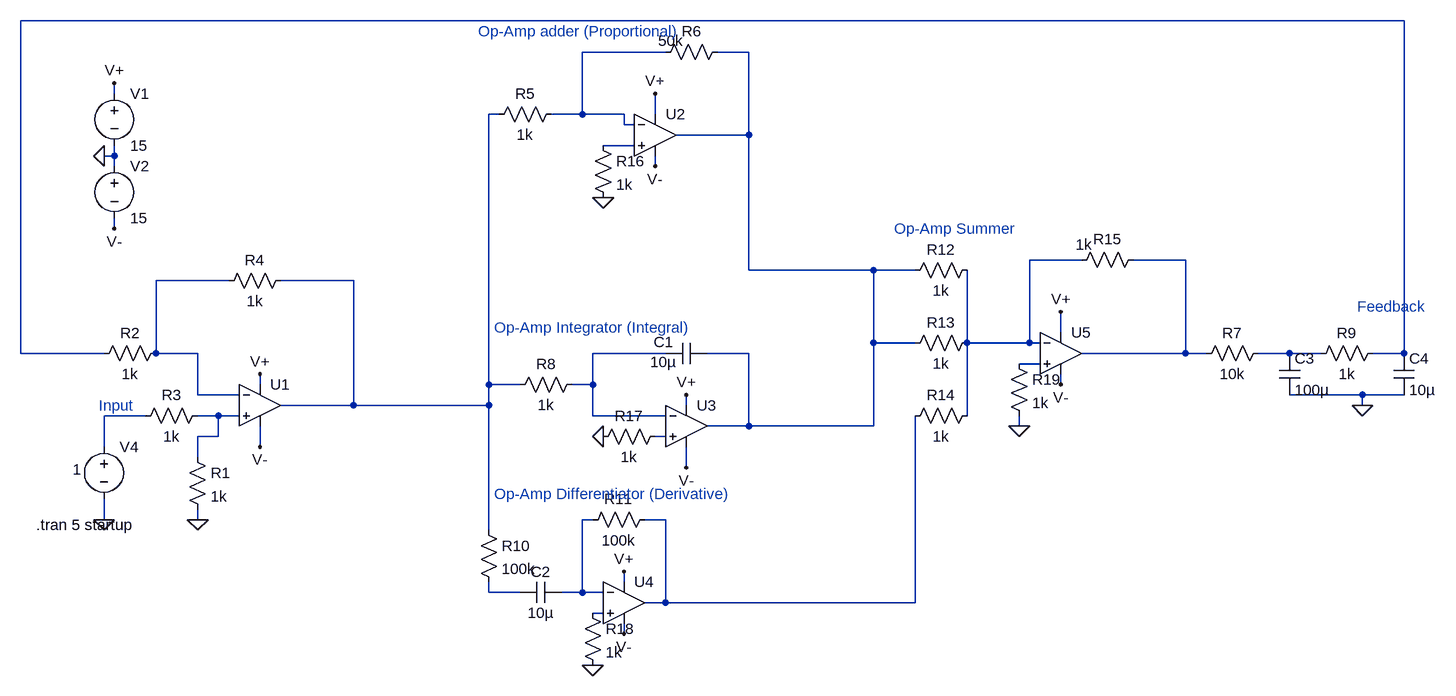
[diagram p0: schematic PID Controller.asc]
PID Controller.asc, the LTspice schematic file:
Version 4.1
SHEET 1 2156 680
WIRE 1408 -480 -720 -480
WIRE 272 -432 144 -432
WIRE 400 -432 352 -432
WIRE -576 -368 -576 -384
WIRE 16 -336 0 -336
WIRE 144 -336 144 -432
WIRE 144 -336 96 -336
WIRE 208 -336 144 -336
WIRE 256 -336 256 -368
WIRE 208 -320 208 -336
WIRE 224 -320 208 -320
WIRE 400 -304 400 -432
WIRE 400 -304 288 -304
WIRE 224 -288 176 -288
WIRE -576 -272 -576 -288
WIRE -576 -272 -592 -272
WIRE -576 -256 -576 -272
WIRE 256 -256 256 -272
WIRE -576 -160 -576 -176
WIRE 912 -112 832 -112
WIRE 1072 -112 992 -112
WIRE 400 -96 400 -304
WIRE 592 -96 400 -96
WIRE 656 -96 592 -96
WIRE -400 -80 -512 -80
WIRE -208 -80 -320 -80
WIRE 880 0 880 -32
WIRE 592 16 592 -96
WIRE 656 16 592 16
WIRE 736 16 736 -96
WIRE 832 16 832 -112
WIRE 832 16 736 16
WIRE 848 16 832 16
WIRE -720 32 -720 -480
WIRE -592 32 -720 32
WIRE -512 32 -512 -80
WIRE -448 32 -512 32
WIRE 272 32 160 32
WIRE 400 32 336 32
WIRE 1072 32 1072 -112
WIRE 1072 32 912 32
WIRE 1104 32 1072 32
WIRE 1232 32 1184 32
WIRE 1280 32 1232 32
WIRE 1408 32 1408 -480
WIRE 1408 32 1360 32
WIRE 848 48 816 48
WIRE -352 80 -352 64
WIRE 0 80 0 -336
WIRE 48 80 0 80
WIRE 160 80 160 32
WIRE 160 80 128 80
WIRE 880 80 880 64
WIRE -448 96 -448 32
WIRE -384 96 -448 96
WIRE 1344 96 1232 96
WIRE 1408 96 1344 96
WIRE -208 112 -208 -80
WIRE -208 112 -320 112
WIRE 0 112 0 80
WIRE 0 112 -208 112
WIRE 304 112 304 96
WIRE 1344 112 1344 96
WIRE -528 128 -592 128
WIRE -416 128 -448 128
WIRE -384 128 -416 128
WIRE 160 128 160 80
WIRE 272 128 160 128
WIRE 736 128 736 16
WIRE 400 144 400 32
WIRE 400 144 336 144
WIRE 592 144 592 16
WIRE 592 144 400 144
WIRE 816 144 816 128
WIRE -416 160 -416 128
WIRE -416 160 -448 160
WIRE 272 160 256 160
WIRE -592 176 -592 128
WIRE -352 176 -352 144
WIRE -448 192 -448 160
WIRE 304 208 304 176
WIRE -592 288 -592 256
WIRE -448 288 -448 272
WIRE 160 288 144 288
WIRE 272 288 240 288
WIRE 0 304 0 112
WIRE 208 384 208 368
WIRE 0 400 0 384
WIRE 48 400 0 400
WIRE 144 400 144 288
WIRE 144 400 112 400
WIRE 176 400 144 400
WIRE 272 416 272 288
WIRE 272 416 240 416
WIRE 656 416 656 128
WIRE 656 416 272 416
WIRE 176 432 160 432
WIRE 208 464 208 448
FLAG -448 288 0
FLAG -592 288 0
FLAG -592 -272 0
FLAG -576 -384 V+
FLAG 256 -368 V+
FLAG 880 -32 V+
FLAG 208 368 V+
FLAG 304 96 V+
FLAG -352 64 V+
FLAG 256 -256 V-
FLAG 304 208 V-
FLAG 208 464 V-
FLAG -352 176 V-
FLAG 880 80 V-
FLAG 1344 112 0
FLAG 176 -208 0
FLAG 176 160 0
FLAG 160 512 0
FLAG -576 -160 V-
FLAG 816 144 0
SYMBOL voltage -576 -384 R0
WINDOW 123 0 0 Left 0
WINDOW 39 0 0 Left 0
SYMATTR InstName V1
SYMATTR Value 15
SYMBOL voltage -576 -272 R0
WINDOW 123 0 0 Left 0
WINDOW 39 0 0 Left 0
SYMATTR InstName V2
SYMATTR Value 15
SYMBOL voltage -592 160 R0
WINDOW 3 -48 51 Left 2
WINDOW 123 0 0 Left 0
WINDOW 39 0 0 Left 0
SYMATTR Value 1
SYMATTR InstName V4
SYMBOL res -464 176 R0
SYMATTR InstName R1
SYMATTR Value 1k
SYMBOL res -496 16 R90
WINDOW 0 0 56 VBottom 2
WINDOW 3 32 56 VTop 2
SYMATTR InstName R2
SYMATTR Value 1k
SYMBOL res -432 112 R90
WINDOW 0 0 56 VBottom 2
WINDOW 3 32 56 VTop 2
SYMATTR InstName R3
SYMATTR Value 1k
SYMBOL res -304 -96 R90
WINDOW 0 0 56 VBottom 2
WINDOW 3 32 56 VTop 2
SYMATTR InstName R4
SYMATTR Value 1k
SYMBOL OpAmps\\UniversalOpAmp -352 112 R0
SYMATTR InstName U1
SYMBOL res 368 -448 R90
WINDOW 0 0 56 VBottom 2
WINDOW 3 -17 88 VTop 2
SYMATTR InstName R6
SYMATTR Value 50k
SYMBOL res 112 -352 R90
WINDOW 0 0 56 VBottom 2
WINDOW 3 32 56 VTop 2
SYMATTR InstName R5
SYMATTR Value 1k
SYMBOL OpAmps\\UniversalOpAmp 256 -304 R0
SYMATTR InstName U2
SYMBOL cap 336 16 R90
WINDOW 0 14 67 VBottom 2
WINDOW 3 14 67 VTop 2
SYMATTR InstName C1
SYMATTR Value 10µ
SYMBOL OpAmps\\UniversalOpAmp 304 144 R0
SYMATTR InstName U3
SYMBOL res 144 64 R90
WINDOW 0 0 56 VBottom 2
WINDOW 3 32 56 VTop 2
SYMATTR InstName R8
SYMATTR Value 1k
SYMBOL cap 112 384 R90
WINDOW 0 0 32 VBottom 2
WINDOW 3 32 32 VTop 2
SYMATTR InstName C2
SYMATTR Value 10µ
SYMBOL OpAmps\\UniversalOpAmp 208 416 R0
SYMATTR InstName U4
SYMBOL res -16 288 R0
SYMATTR InstName R10
SYMATTR Value 100k
SYMBOL res 752 -112 R90
WINDOW 0 0 56 VBottom 2
WINDOW 3 32 56 VTop 2
SYMATTR InstName R12
SYMATTR Value 1k
SYMBOL res 752 0 R90
WINDOW 0 0 56 VBottom 2
WINDOW 3 32 56 VTop 2
SYMATTR InstName R13
SYMATTR Value 1k
SYMBOL res 752 112 R90
WINDOW 0 0 56 VBottom 2
WINDOW 3 32 56 VTop 2
SYMATTR InstName R14
SYMATTR Value 1k
SYMBOL OpAmps\\UniversalOpAmp 880 32 R0
SYMATTR InstName U5
SYMBOL res 1008 -128 R90
WINDOW 0 0 56 VBottom 2
WINDOW 3 -23 92 VTop 2
SYMATTR InstName R15
SYMATTR Value 1k
SYMBOL res 256 272 R90
WINDOW 0 0 56 VBottom 2
WINDOW 3 32 56 VTop 2
SYMATTR InstName R11
SYMATTR Value 100k
SYMBOL res 1200 16 R90
WINDOW 0 0 56 VBottom 2
WINDOW 3 32 56 VTop 2
SYMATTR InstName R7
SYMATTR Value 10k
SYMBOL res 1376 16 R90
WINDOW 0 0 56 VBottom 2
WINDOW 3 32 56 VTop 2
SYMATTR InstName R9
SYMATTR Value 1k
SYMBOL cap 1216 32 R0
SYMATTR InstName C3
SYMATTR Value 100µ
SYMBOL cap 1392 32 R0
SYMATTR InstName C4
SYMATTR Value 10µ
SYMBOL res 160 -304 R0
SYMATTR InstName R16
SYMATTR Value 1k
SYMBOL res 272 144 R90
WINDOW 0 0 56 VBottom 2
WINDOW 3 32 56 VTop 2
SYMATTR InstName R17
SYMATTR Value 1k
SYMBOL res 144 416 R0
SYMATTR InstName R18
SYMATTR Value 1k
SYMBOL res 800 32 R0
SYMATTR InstName R19
SYMATTR Value 1k
TEXT -696 296 Left 2 !.tran 5 startup
TEXT -16 -464 Left 2 ;Op-Amp adder (Proportional)
TEXT 8 248 Left 2 ;Op-Amp Differentiator (Derivative)
TEXT 8 -8 Left 2 ;Op-Amp Integrator (Integral)
TEXT 624 -160 Left 2 ;Op-Amp Summer
TEXT 1336 -40 Left 2 ;Feedback
TEXT -600 112 Left 2 ;Input

The netlist it stands for:
* PID Controller.asc
V1 V+ 0 15
V2 0 V- 15
V4 N012 0 1
R1 N013 0 1k
R2 N008 N001 1k
R3 N013 N012 1k
R4 N004 N008 1k
X§U1 N013 N008 V+ V- N004 level1 Avol=1Meg GBW=10Meg Vos=0 En=0 Enk=0 In=0 Ink=0 Rin=500Meg  ; pins In+ In- V+ V- OUT
R6 N003 N002 50k
R5 N002 N004 1k
X§U2 N005 N002 V+ V- N003 level1 Avol=1Meg GBW=10Meg Vos=0 En=0 Enk=0 In=0 Ink=0 Rin=500Meg  ; pins In+ In- V+ V- OUT
C1 N003 N009 10µ
X§U3 N014 N009 V+ V- N003 level1 Avol=1Meg GBW=10Meg Vos=0 En=0 Enk=0 In=0 Ink=0 Rin=500Meg  ; pins In+ In- V+ V- OUT
R8 N009 N004 1k
C2 N015 N017 10µ
X§U4 N018 N015 V+ V- N016 level1 Avol=1Meg GBW=10Meg Vos=0 En=0 Enk=0 In=0 Ink=0 Rin=500Meg  ; pins In+ In- V+ V- OUT
R10 N004 N017 100k
R12 N006 N003 1k
R13 N006 N003 1k
R14 N006 N016 1k
X§U5 N011 N006 V+ V- N007 level1 Avol=1Meg GBW=10Meg Vos=0 En=0 Enk=0 In=0 Ink=0 Rin=500Meg  ; pins In+ In- V+ V- OUT
R15 N007 N006 1k
R11 N016 N015 100k
R7 N010 N007 10k
R9 N001 N010 1k
C3 N010 0 100µ
C4 N001 0 10µ
R16 N005 0 1k
R17 N014 0 1k
R18 N018 0 1k
R19 N011 0 1k
.tran 5 startup
* Op-Amp adder (Proportional)
* Op-Amp Differentiator (Derivative)
* Op-Amp Integrator (Integral)
* Op-Amp Summer
* Feedback
* Input
.lib UniversalOpAmp1.lib
.backanno
.end